# EAGLE design controller_board (EAGLE 7.2.0)
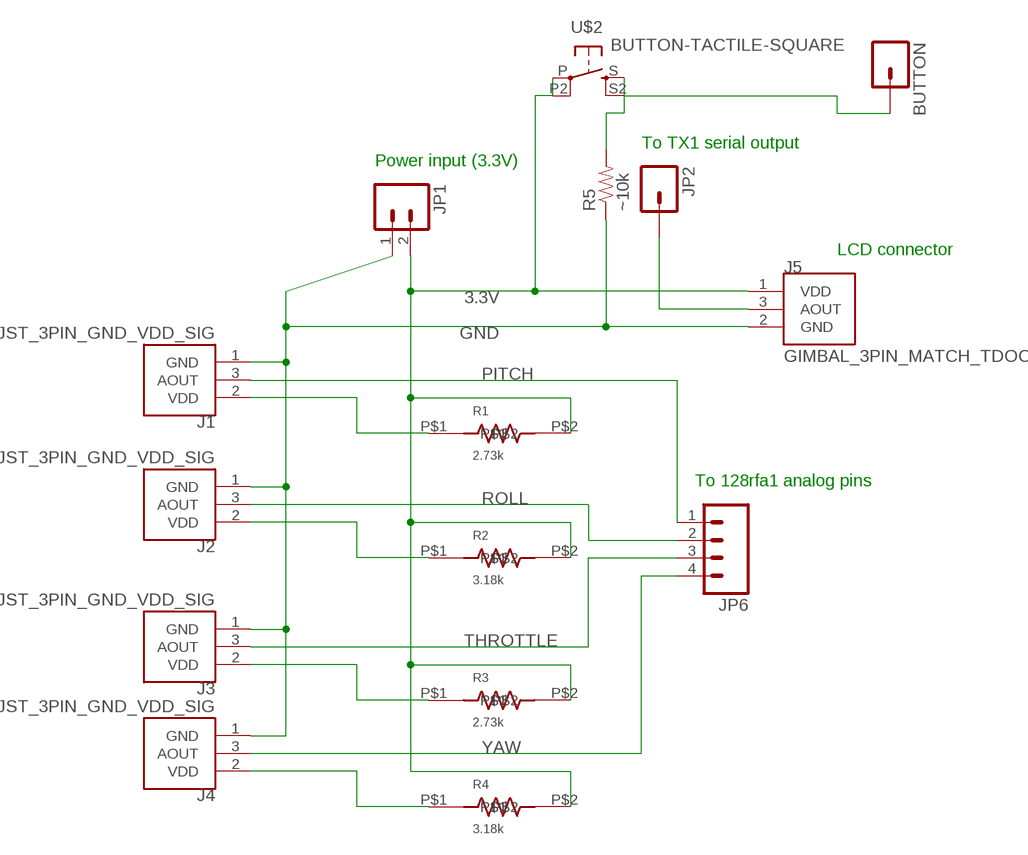
[diagram p0: schematic, sheet 1]

## Parts
BUTTON  M01PTH  [1X01]
J1  JST_3PIN_GND_VDD_SIG  [JST-3-PTH-REVERSE]
J2  JST_3PIN_GND_VDD_SIG  [JST-3-PTH-REVERSE]
J3  JST_3PIN_GND_VDD_SIG  [JST-3-PTH-REVERSE]
J4  JST_3PIN_GND_VDD_SIG  [JST-3-PTH-REVERSE]
J5  GIMBAL_3PIN_MATCH_TDOCU  [JST-3-PTH]
JP1  M021X02_NO_SILK  [1X02_NO_SILK]
JP2  M01PTH  [1X01]
JP6  M04PTH  [1X04]
R1  2.73k  RESISTOR-THROUGH_HOLE  [CRF12]
R2  3.18k  RESISTOR-THROUGH_HOLE  [CRF12]
R3  2.73k  RESISTOR-THROUGH_HOLE  [CRF12]
R4  3.18k  RESISTOR-THROUGH_HOLE  [CRF12]
R5  ~10k  RESISTORPTH-1/4W  [AXIAL-0.4]
U$2  BUTTON-TACTILE-SQUARE  [BUTTON-TACTILE-SQUARE-ADAFRUIT1010]

## Nets
3.3V: J5.1(VDD) JP1.2 R1.P$2 R2.P$2 R3.P$2 R4.P$2 U$2.P U$2.P2(P1)
GND: J1.1(GND) J2.1(GND) J3.1(GND) J4.1(GND) J5.2(GND) JP1.1 R5.P$1
N$1: J1.2(VDD) R1.P$1
N$2: J2.2(VDD) R2.P$1
N$3: J3.2(VDD) R3.P$1
N$4: J4.2(VDD) R4.P$1
N$6: BUTTON.1 R5.P$2 U$2.S U$2.S2(S1)
N$9: J5.3(AOUT) JP2.1
PITCH: J1.3(AOUT) JP6.1
ROLL: J2.3(AOUT) JP6.2
THROTTLE: J3.3(AOUT) JP6.3
YAW: J4.3(AOUT) JP6.4

## Notes on the sheet
- To TX1 serial output
- Power input (3.3V)
- LCD connector
- To 128rfa1 analog pins

## Library data of the parts
BUTTON JP2 = SparkFun-Connectors:M01: Header 1 Standard 1-pin 0.1" header. Use with straight break away headers (SKU : PRT-00116), right angle break away headers (PRT-00553), swiss pins (PRT-00743), machine pins (PRT-00117), and female headers (PRT-00115).
J1-J4 = Controller:JST_3PIN_GND_VDD_SIG
J5 = Controller:GIMBAL_3PIN_MATCH_TDOCU
JP1 = SparkFun-Connectors:M02: Standard 2-pin 0.1" header. Use with - straight break away headers ( PRT-00116) - right angle break away headers (PRT-00553) - swiss pins (PRT-00743) - machine pins (PRT-00117) - female headers (PRT-00115) Molex polarized connector foot print use with: PRT-08233 with associated crimp pins and housings. 2.54_SCREWTERM for use with PRT-10571. 3.5mm Screw Terminal footprints for PRT-08084 5mm Screw Terminal footprints for use with PRT-08432
JP6 = SparkFun-Connectors:M04: Header 4 Standard 4-pin 0.1" header. Use with straight break away headers (SKU : PRT-00116), right angle break away headers (PRT-00553), swiss pins (PRT-00743), machine pins (PRT-00117), and female headers (PRT-00115). Molex polarized connector foot print use with SKU : PRT-08231 with associated crimp pins and housings. 1MM SMD Version SKU: PRT-10208
R1-R4 = DanielKnapp-lab4:RESISTOR; CREATOR: Daniel Knapp; DIST: Digikey
R5 = SparkFun-Resistors:RESISTOR: Resistor Basic schematic elements and footprints for 0603, 1206, and PTH resistors.
U$2 = Controller:BUTTON-TACTILE

## Board
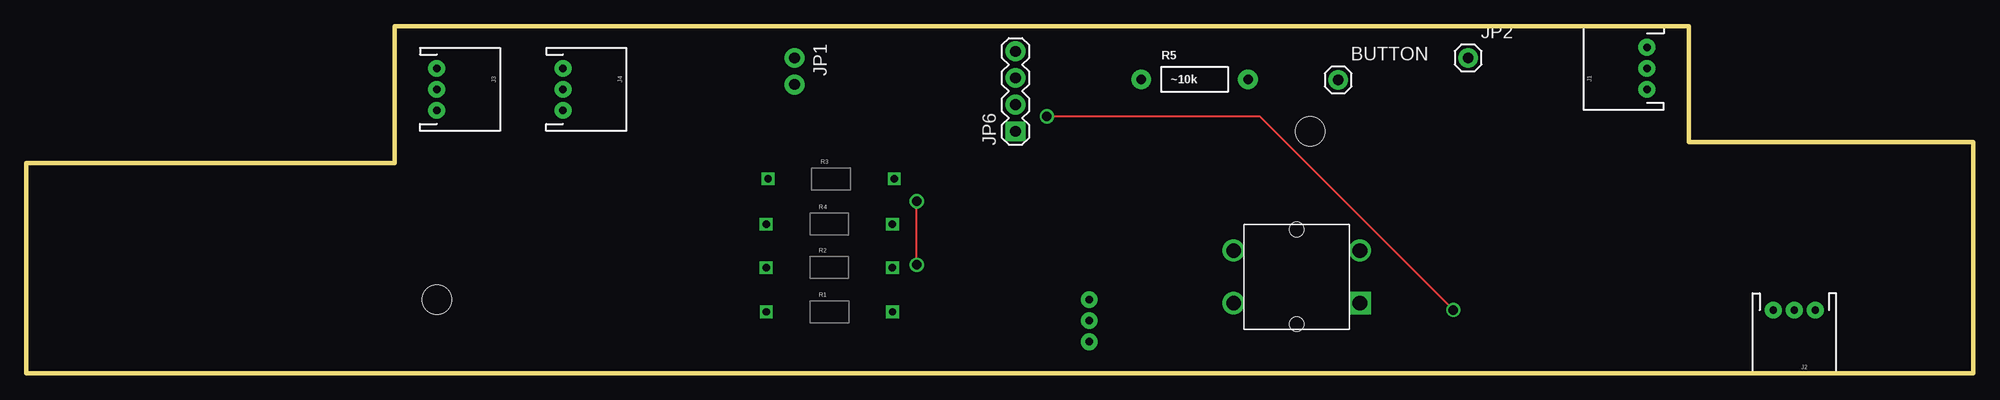
[diagram p1: board, top side]
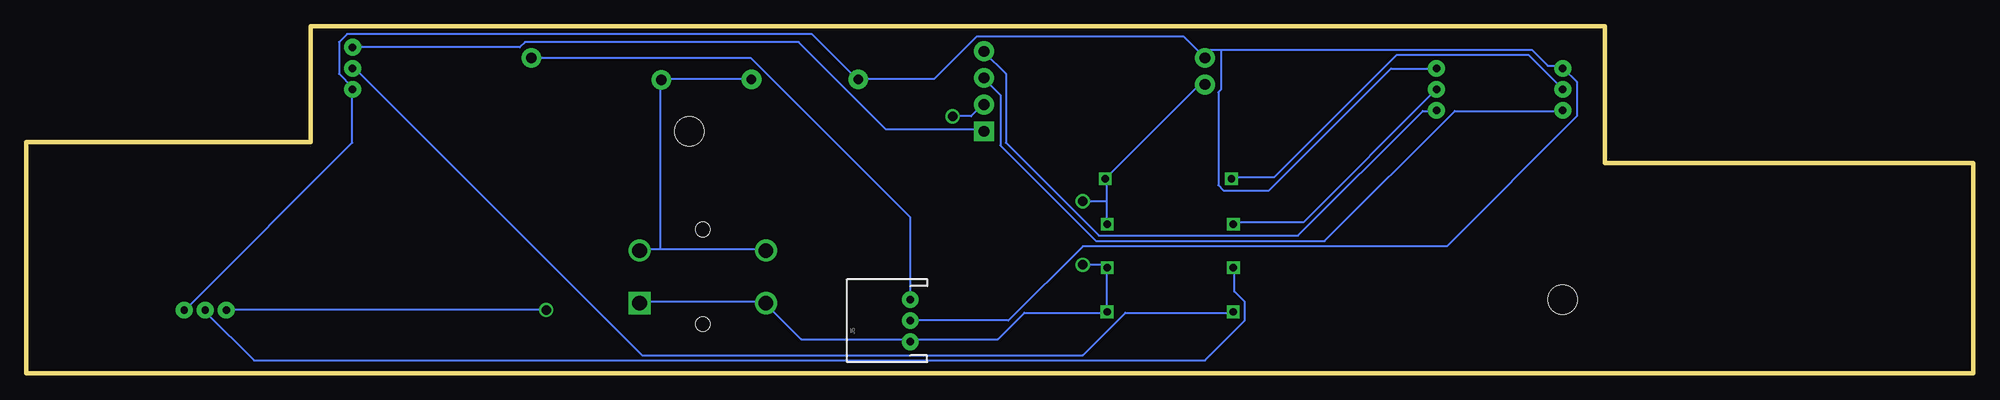
[diagram p2: board, bottom side, seen from below]

Size 185 x 33 mm. Coordinates in mm from the lower left corner, seen from the top.
Outline: 158,22 158,33 35,33 35,20 0,20 0,0 185,0 185,22 158,22
Copper layers (1*16): Top 0.035559375mm / dielectric 1.501140625mm / Bottom 0.035559375mm
Design rules "4pcb-33board *": minimum track width 0.2mm, minimum drill 0.9mm, track to track 12mil, track to pad 12mil, pad to pad 12mil, via to via 12mil, smd to smd 12mil, copper to edge 10mil, drill to drill 10mil, minimum pad ring 10mil, minimum via ring 8mil, stop-mask expansion 4mil, vias tented up to drill 0mil, thermal gap 10mil
tRestrict: area 38,24 to 40,30.1; area 49.9,24 to 52.2,30; area 71.7,26.2 to 74.6,31.5; area 69.3,17.3 to 71.7,19.6; area 81.4,17.3 to 83.7,19.7; area 69.2,12.9 to 71.6,15.4; area 81.4,13 to 83.5,15.4; area 69.2,8.9 to 71.4,11.1; area 81.4,8.9 to 83.5,11.1; area 69.2,4.7 to 71.5,7.1; area 81.5,4.7 to 83.6,7; area 92.4,21.4 to 95.9,32.2; 11 more areas
vRestrict: area 36.7,22.2 to 45.8,31.6; area 48.7,22 to 58.3,31.8; area 71.4,25.8 to 75,31.7; area 69,16.8 to 83.9,20.2; area 69.2,12.4 to 84,15.8; area 69.3,8.4 to 83.9,11.6; area 69.4,4.2 to 84,7.3; area 92,20.9 to 96.2,32.5; area 104.4,26.1 to 117.9,29.7; area 98.6,0.5 to 108.2,9.8; area 113.2,3.4 to 128.5,14.9; area 122.7,25.9 to 126.9,29.7; 3 more areas

### Footprints (pad centres in the part's own frame; a part is rotated, then mirrored left to right if it is on the bottom)
1X01 = drill 1.016 pad 1.88: 1 0,0
JST-3-PTH-REVERSE = drill 0.7 pad 1.6: 1 -2,0; 2 0,0; 3 2,0
JST-3-PTH = drill 0.7 pad 1.6: 1 -2,0; 2 0,0; 3 2,0
1X02_NO_SILK = drill 1.016 pad 1.88: 1 0,0; 2 2.54,0
1X04 = drill 1.016 pad 1.88 square: 1 0,0 | drill 1.016 pad 1.88: 2 2.54,0; 3 5.08,0; 4 7.62,0
CRF12 = drill 0.7 square: P$1 -6,0; P$2 6,0
AXIAL-0.4 = drill 0.9 pad 1.88: P$1 -5.08,0; P$2 5.08,0
CONNECTOR_BOARD_OUTLINE = hole 2.8: 154,45; 71,29
BUTTON-TACTILE-SQUARE-ADAFRUIT1010 = drill 1.4 square: P -6,2.5 | drill 1.4: P2 6,2.5; S -6,-2.5; S2 6,-2.5 | hole 1.4: 0,-4.5; 0,4.5

### Placement (x,y rotation side)
BUTTON  124.66,27.9 0 top
J1  154,29 90 top
J2  168,6 180 top
J3  39,27 270 top
J4  51,27 270 top
J5  101,5 90 bottom
JP1  73,30 270 top
JP2  137,30 0 top
JP6  94,23 90 top
R1  76.31,5.84 0 top
R2  76.3,10.05 0 top
R3  76.48,18.49 0 top
R4  76.3,14.18 0 top
R5  111.01,27.94 0 top
U$1  [CONNECTOR_BOARD_OUTLINE]  -32,-22 0 top
U$2  120.72,9.17 180 top

### Tracks (layer width: path | path; a pad name or v marks a point on that pad's centre or on a via)
3.3V  (via drill 0.9)
  Top 0.2: v84.61,10.31 v84.61,16.37
  Bottom 0.2: 82.34,16.37 82.34,18.38 R3.P$2 82.34,18.64 73.76,27.22 73.25,27.22 JP1.2 | 82.34,16.37 82.34,14.35 R4.P$2 | U$2.P 126.51,6.77 114.9,6.77 U$2.P2 114.64,6.52 111.36,3.24 101.01,3.24 J5.1 100.76,3.24 92.69,3.24 90.16,5.76 82.34,5.76 R1.P$2 82.34,6.02 82.34,9.8 R2.P$2 82.34,10.05 82.59,10.31 v84.61,10.31 | v84.61,16.37 82.34,16.37
GND
  Bottom 0.2: J2.1 169.92,6.02 154.02,21.92 154.02,26.97 J1.1 154.02,27.22 155.28,28.48 155.28,31.51 154.52,32.27 110.35,32.27 106.06,27.98 R5.P$1 105.81,27.98 98.74,27.98 94.7,32.01 75.02,32.01 73.25,30.25 JP1.1 73,30.25 72.49,30.75 71.48,30.75 | 71.48,30.75 41.95,30.75 40.44,29.24 39.18,29.24 J3.1 38.92,28.98 37.66,27.72 37.66,24.44 50.03,12.07 84.61,12.07 91.68,5.01 100.76,5.01 J5.2 | 71.48,30.75 71.48,26.97 71.74,26.71 71.74,17.88 71.23,17.37 66.94,17.37 55.33,28.98 51.04,28.98 J4.1
N$1
  Bottom 0.2: R1.P$1 70.47,5.76 80.57,5.76 84.61,1.73 126.51,1.73 153.77,28.98 J1.2
N$2
  Bottom 0.2: R2.P$1 70.22,9.8 70.22,7.78 69.21,6.77 69.21,5.01 73,1.22 163.36,1.22 167.9,5.76 J2.2
N$3
  Bottom 0.2: R3.P$1 70.47,18.64 66.44,18.64 54.83,30.25 42.21,30.25 39.18,27.22 J3.2
N$4
  Bottom 0.2: R4.P$1 70.22,14.35 63.66,14.35 51.04,26.97 J4.2
N$6
  Bottom 0.2: R5.P$2 116.16,27.98 124.49,27.98 BUTTON.1 124.74,27.72 124.74,11.82 | 124.74,11.82 126.51,11.82 U$2.S | 124.74,11.82 114.9,11.82 U$2.S2
N$9
  Bottom 0.2: J5.3 101.01,7.03 101.01,14.85 116.16,29.99 136.86,29.99 JP2.1
PITCH
  Bottom 0.2: J1.3 153.77,31 138.12,31 137.61,31.51 111.62,31.51 103.29,23.18 94.2,23.18 JP6.1
ROLL  (via drill 0.9)
  Top 0.2: v135.59,6.02 117.17,24.44 v96.98,24.44
  Bottom 0.2: v135.59,6.02 165.88,6.02 J2.3 | v96.98,24.44 95.21,24.44 94.2,25.45 JP6.2
THROTTLE
  Bottom 0.2: J3.3 39.18,24.95 49.27,24.95 61.64,12.58 83.35,12.58 92.43,21.66 92.43,26.46 93.95,27.98 JP6.3
YAW
  Bottom 0.2: J4.3 51.04,24.95 52.3,24.95 64.16,13.08 83.09,13.08 91.93,21.92 91.93,28.48 93.95,30.5 JP6.4